# Altium project my_lv_board_db.PrjPcb
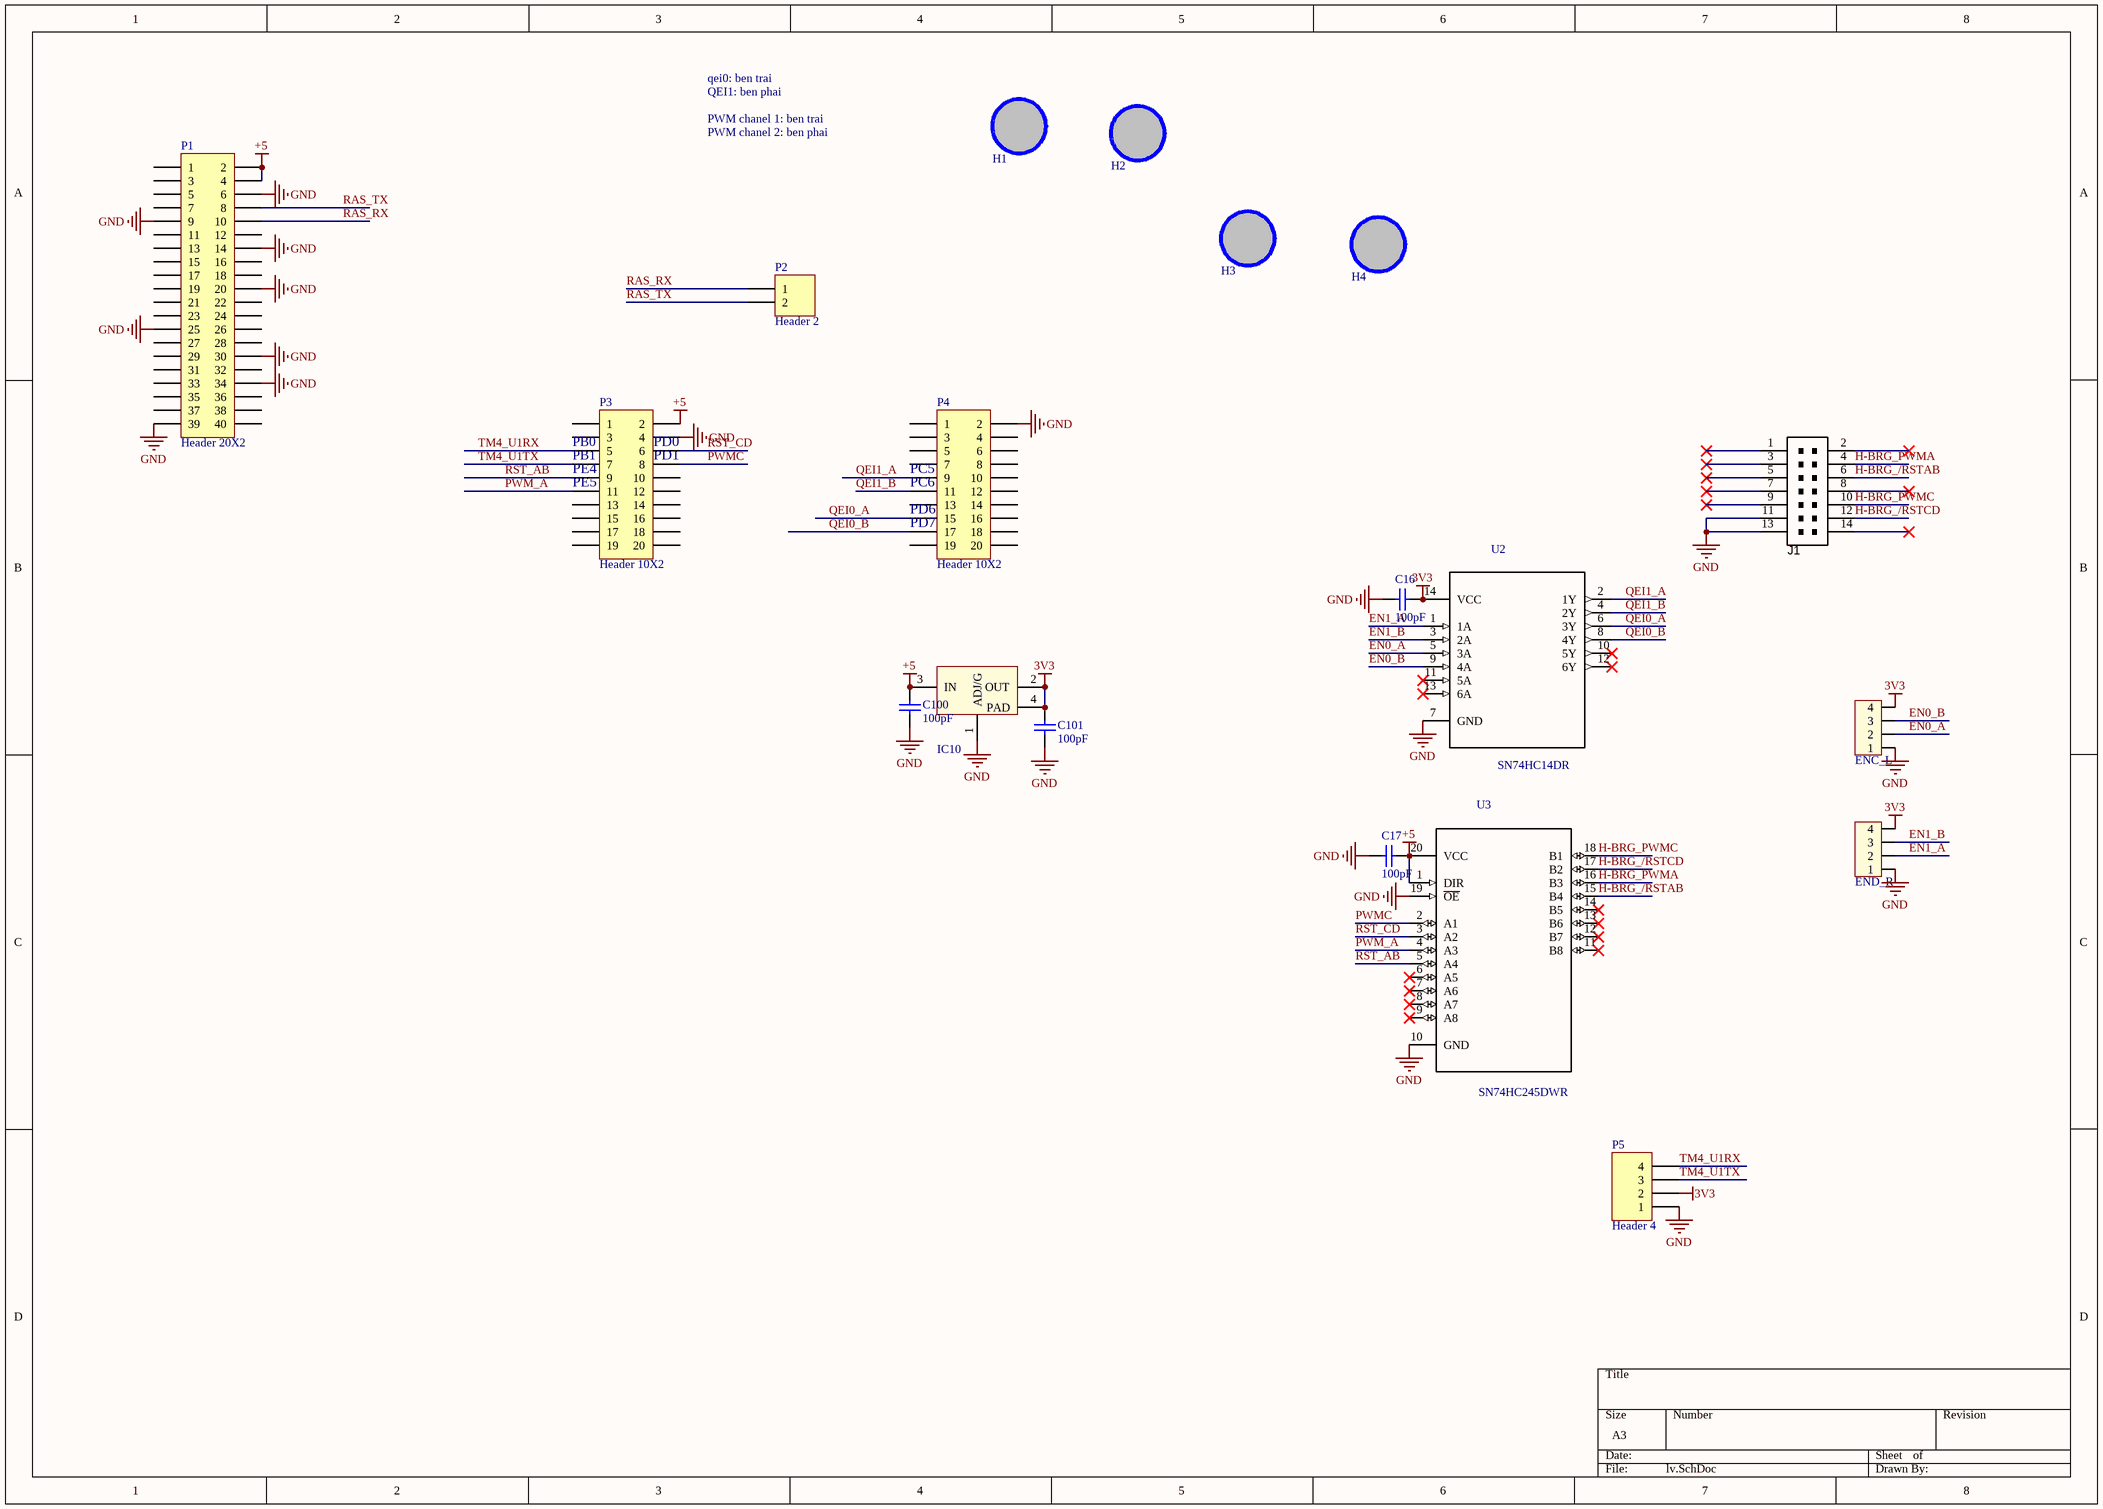
[diagram p0: lv.SchDoc]
2 sheets, 57 parts. Net scope: global (net labels, ports and power ports of the same name join across sheets).
Board file: all.PcbDoc
Sheets:
  lv.SchDoc
  dh.SchDoc

## Sheet lv.SchDoc
size A3

### Parts
C16  value 100pF  [CAP-SM-0805]  (hidden comment: Cap Non-Pol SMD)
C17  value 100pF  [CAP-SM-0805]  (hidden comment: Cap Non-Pol SMD)
C100  value 100pF  [CAP-SM-0805]  (hidden comment: Cap Non-Pol SMD)
C101  value 100pF  [CAP-SM-0805]  (hidden comment: Cap Non-Pol SMD)
ENC_L1  ENC_L  [CON4]
END_R1  END_R  [CON4]
H1  Hole  [LO KHOAN 3MM]  (value not drawn)
H2  Hole  [LO KHOAN 3MM]  (value not drawn)
H3  Hole  [LO KHOAN 3MM]  (value not drawn)
H4  Hole  [LO KHOAN 3MM]  (value not drawn)
IC10  LM1117  [SOT223-4N]  (value not drawn)
J1  shrouded box header  [14P_PCB_HEADER_BRD_MNT_RA]  (value not drawn)
P1  Header 20X2  [HDR2X20]
P2  Header 2  [HDR1X2]
P3  Header 10X2  [HDR2X10]
P4  Header 10X2  [HDR2X10]
P5  Header 4  [HDR1X4]
U2  SN74HC14DR  [*SOIC127P600X175-14N]
U3  SN74HC245DWR  [*SOIC127P1030X265-20N]

### Nets
3V3: C16.1 C101.2 ENC_L1.4 END_R1.4 IC10.2(OUT) IC10.4(PAD) P5.2 U2.14(VCC)
+5: C17.1 C100.2 IC10.3(IN) P1.2 P1.4 P3.2 U3.1(DIR) U3.20(VCC)
GND: C16.2 C17.2 C100.1 C101.1 ENC_L1.1 END_R1.1 IC10.1(ADJ/G) J1.11 J1.13 P1.6 P1.9 P1.14 P1.20 P1.25 P1.30 P1.34 P1.39 P3.4 P4.2 P5.1 U2.7(GND) U3.10(GND) U3.19(~{OE})
EN0_A: ENC_L1.2 U2.5(3A)
EN0_B: ENC_L1.3 U2.9(4A)
EN1_A: END_R1.2 U2.1(1A)
EN1_B: END_R1.3 U2.3(2A)
H-BRG_/RSTAB: J1.6 U3.15(B4)
H-BRG_/RSTCD: J1.12 U3.17(B2)
H-BRG_PWMA: J1.4 U3.16(B3)
H-BRG_PWMC: J1.10 U3.18(B1)
PWM_A: P3.11 U3.4(A3)
PWMC: P3.8 U3.2(A1)
QEI0_A: P4.15 U2.6(3Y)
QEI0_B: P4.17 U2.8(4Y)
QEI1_A: P4.9 U2.2(1Y)
QEI1_B: P4.11 U2.4(2Y)
RAS_RX: P1.10 P2.1
RAS_TX: P1.8 P2.2
RST_AB: P3.9 U3.5(A4)
RST_CD: P3.6 U3.3(A2)
TM4_U1RX: P3.5 P5.4
TM4_U1TX: P3.7 P5.3

Not connected (* = marked no-connect by the designer): H1 1; H2 1; H3 1; H4 1; J1 1* 2* 3* 5* 7* 8* 9* 14*; P1 1 3 5 7 11 12 13 15 16 17 18 19 21 22 23 24 26 27 28 29 31 32 33 35 36 37 38 40; P3 1 3 10 12 13 14 15 16 17 18 19 20; P4 1 3 4 5 6 7 8 10 12 13 14 16 18 19 20; U2 10(5Y)* 11(5A)* 12(6Y)* 13(6A)*; U3 6(A5)* 7(A6)* 8(A7)* 9(A8)* 11(B8)* 12(B7)* 13(B6)* 14(B5)*

### Notes on the sheet
- qei0: ben trai
- QEI1: ben phai
- PWM chanel 1: ben trai
- PWM chanel 2: ben phai
- (near P3) PB0
- (near P3) PD0
- (near P3) PE4
- (near P3) PE5
- (near P3) PB1
- (near P3) PD1
- (near P4) PC5
- (near P4) PC6
- (near P4) PD6
- (near P4) PD7

### Library data of the parts
C16 C17 C100 C101 = Cap Non-Pol SMD: Capacitor
ENC_L1 END_R1 = Con4: Connector 4; Value: Connector 4
H1-H4 = Hole: Hole 3mm
IC10 = LM1117: Available in 1.8V, 2.5V, 2.85V, 3.3V, 5V, and  Adjustable Versions; Value: LM317
J1 = CONN_HEADER_2x7P_RA_0.100in_Male: Header THD 14 POS Double-row right-angle 2.54mm pitch; Manufacturer 1: 3M; Manufacturer Part Number 1: D2514-5002-AR; Pitch: 0.100" (2.54mm); Value: Double-row, 14 positions; QtyOverride: 1; Connector Type: Header, Shrouded; Number of Positions: 14; SCDType: source; Package / Case: Connector header; 2.54mm pitch; Contact Type: Male Pin; Number of Rows: 2; Row Spacing: 0.100" (2.54mm); Contact Mating Length: 0.243" (6.17mm); ComponentLink1URL: http://multimedia.3m.com/mws/mediawebserver?66666UuZjcFSLXTtm8T_oxMcEVuQEcuZgVs6EVs6E666666--; ComponentLink1Description: http://multimedia.3m.com/mws/mediawebserver?66666UuZjcFSLXTtm8T_oxMcEVuQEcuZgVs6EVs6E666666--; Supplier 1: Digi-Key; Supplier Part Number 1: MHE14E-ND
P1 = Header 20X2: Header, 20-Pin, Dual row; LatestRevisionDate: 17-Jul-2002; LatestRevisionNote: Re-released for DXP Platform.; Publisher: Altium Limited
P2 = Header 2: Header, 2-Pin; LatestRevisionDate: 17-Jul-2002; LatestRevisionNote: Re-released for DXP Platform.; Publisher: Altium Limited
P3 P4 = Header 10X2: Header, 10-Pin, Dual row; LatestRevisionDate: 17-Jul-2002; LatestRevisionNote: Re-released for DXP Platform.; Publisher: Altium Limited
P5 = Header 4: Header, 4-Pin; LatestRevisionDate: 17-Jul-2002; LatestRevisionNote: Re-released for DXP Platform.; Publisher: Altium Limited
U2 = SN74HC14DR: Inverter Schmitt Trigger 6-Element CMOS 14-Pin SOIC T/R; MF: Texas Instruments; Price: None; Availability: Unavailable; MP: SN74HC14DR; Package: SOIC-14 Texas Instruments; SnapEDA_Link: https://www.snapeda.com/parts/SN74HC14DR/Texas%20Instruments/view-part/?ref=snap; Value: *
U3 = SN74HC245DWR: Logic IC - Receiver, transceiver Texas Instruments SN74HC245DWR SOIC 20; Price: None; Availability: Unavailable; MP: SN74HC245DWR; Package: SOIC-20 Texas Instruments; SnapEDA_Link: https://www.snapeda.com/parts/SN74HC245DWR/Texas%20Instruments/view-part/?ref=snap; MF: Texas Instruments; Value: *

## Sheet dh.SchDoc
size A
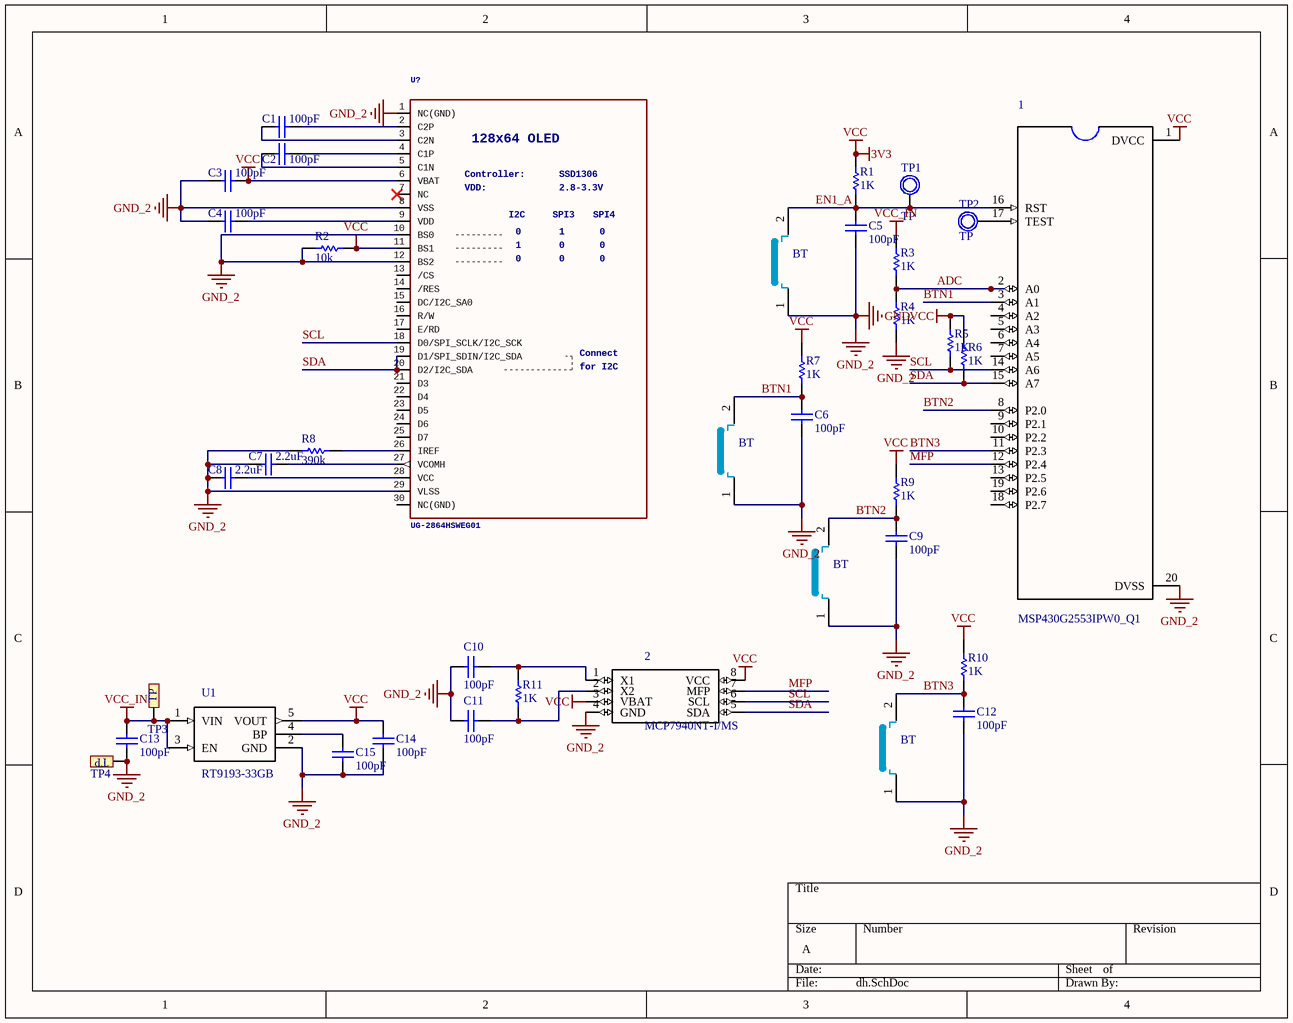
[diagram p1: dh.SchDoc]

### Parts
1  MSP430G2553IPW0_Q1  [*TSSOP-20]
2  MCP7940NT-I/MS  [*SOP65P640X120-8N]
BT1  BT  [SW-SMD]
BT2  BT  [SW-SMD]
BT3  BT  [SW-SMD]
BT4  BT  [SW-SMD]
C1  value 100pF  [CAP-SM-0603]  (hidden comment: Cap Non-Pol SMD)
C2  value 100pF  [CAP-SM-0603]  (hidden comment: Cap Non-Pol SMD)
C3  value 100pF  [CAP-SM-0603]  (hidden comment: Cap Non-Pol SMD)
C4  value 100pF  [CAP-SM-0603]  (hidden comment: Cap Non-Pol SMD)
C5  value 100pF  [CAP-SM-0603]  (hidden comment: Cap Non-Pol SMD)
C6  value 100pF  [CAP-SM-0603]  (hidden comment: Cap Non-Pol SMD)
C7  value 2.2uF  [CAP-SM-0603]  (hidden comment: Cap Non-Pol SMD)
C8  value 2.2uF  [CAP-SM-0603]  (hidden comment: Cap Non-Pol SMD)
C9  value 100pF  [CAP-SM-0603]  (hidden comment: Cap Non-Pol SMD)
C10  value 100pF  [CAP-SM-0603]  (hidden comment: Cap Non-Pol SMD)
C11  value 100pF  [CAP-SM-0603]  (hidden comment: Cap Non-Pol SMD)
C12  value 100pF  [CAP-SM-0603]  (hidden comment: Cap Non-Pol SMD)
C13  value 100pF  [CAP-SM-0603]  (hidden comment: Cap Non-Pol SMD)
C14  value 100pF  [CAP-SM-0603]  (hidden comment: Cap Non-Pol SMD)
C15  value 100pF  [CAP-SM-0603]  (hidden comment: Cap Non-Pol SMD)
R1  value 1K  [RES-SM-0603]  (hidden comment: RESISTOR SMD)
R2  value 10k  [RES-SM-0603]  (hidden comment: RESISTOR SMD)
R3  value 1K  [RES-SM-0603]  (hidden comment: RESISTOR SMD)
R4  value 1K  [RES-SM-0603]  (hidden comment: RESISTOR SMD)
R5  value 1K  [RES-SM-0603]  (hidden comment: RESISTOR SMD)
R6  value 1K  [RES-SM-0603]  (hidden comment: RESISTOR SMD)
R7  value 1K  [RES-SM-0603]  (hidden comment: RESISTOR SMD)
R8  value 390k  [RES-SM-0603]  (hidden comment: RESISTOR SMD)
R9  value 1K  [RES-SM-0603]  (hidden comment: RESISTOR SMD)
R10  value 1K  [RES-SM-0603]  (hidden comment: RESISTOR SMD)
R11  value 1K  [RES-SM-0603]  (hidden comment: RESISTOR SMD)
TP1  TP  [TP1]
TP2  TP  [TP1]
TP3  Test Point  [TP]  (value not drawn)
TP4  Test Point  [TP]  (value not drawn)
U1  RT9193-33GB  [*SOT94P279X129-5N]
U?  UG-2864HSWEG01  128x64OLED: 128x64 OLED  forI2C: for I2C  Controller: Controller:  VDD: VDD:  [my_footprint]

### Nets
3V3: 1.1(DVCC) 2.3(VBAT) 2.8(VCC) C3.2 C14.2 R1.2 R2.2 R5.2 R6.2 R7.2 R9.2 R10.2 U1.5(VOUT) U?.6(VBAT) U?.11(BS1)  [also labelled VCC]
GND: 1.20(DVSS) 2.4(GND) BT1.1 BT2.1 BT3.1 BT4.1 C3.1 C4.1 C5.1 C6.1 C7.1 C8.1 C9.1 C10.1 C11.1 C12.1 C13.1 C14.1 C15.1 R2.1 R4.1 R8.1 TP4.TP1 U1.2(GND) U?.1(NC(GND)) U?.8(VSS) U?.10(BS0) U?.12(BS2) U?.29(VLSS)  [also labelled GND_2]
VCC_IN: C13.2 R3.2 TP3.TP1 U1.1(VIN) U1.3(EN)
ADC: 1.2(A0) R3.1 R4.2
BTN1: 1.3(A1) BT2.2 C6.2 R7.1
BTN2: 1.8(P2.0) BT3.2 C9.2 R9.1
BTN3: 1.11(P2.3) BT4.2 C12.2 R10.1
EN1_A: 1.16(RST) BT1.2 C5.2 R1.1 TP1.1
MFP: 1.12(P2.4) 2.7(MFP)
SCL: 1.14(A6) 2.6(SCL) R5.1 U?.18(D0/SPI_SCLK/I2C_SCK)
SDA: 1.15(A7) 2.5(SDA) R6.1 U?.19(D1/SPI_SDIN/I2C_SDA) U?.20(D2/I2C_SDA)
Net1_17: 1.17(TEST) TP2.1
Net2_1: 2.1(X1) C10.2 R11.2
Net2_2: 2.2(X2) C11.2 R11.1
NetC1_1: C1.1 U?.3(C2N)
NetC1_2: C1.2 U?.2(C2P)
NetC2_1: C2.1 U?.5(C1N)
NetC2_2: C2.2 U?.4(C1P)
NetC4_2: C4.2 U?.9(VDD)
NetC7_2: C7.2 U?.27(VCOMH)
NetC8_2: C8.2 U?.28(VCC)
NetC15_2: C15.2 U1.4(BP)
NetR8_2: R8.2 U?.26(IREF)

Not connected (* = marked no-connect by the designer): 1 4(A2) 5(A3) 6(A4) 7(A5) 9(P2.1) 10(P2.2) 13(P2.5) 18(P2.7) 19(P2.6); U? 7(NC)* 13(/CS) 14(/RES) 15(DC/I2C_SA0) 16(R/W) 17(E/RD) 21(D3) 22(D4) 23(D5) 24(D6) 25(D7) 30(NC(GND))

### Notes on the sheet
- (in symbol Test Point) TP

### Library data of the parts
1 = MSP430G2553IPW0_Q1: MSP430? Ultra-Low-Power Microcontrollers for Automotive Applications 20-TSSOP -40 to 85; MP: MSP430G2553IPW0 Q1; MF: Texas Instruments; Price: None; Availability: Unavailable; Package: TSSOP-20 Texas Instruments; SnapEDA_Link: https://www.snapeda.com/parts/MSP430G2553IPW0%20Q1/Texas%20Instruments/view-part/?ref=snap; Value: *
2 = MCP7940NT-I/MS: Real Time Clock Serial 64Byte 8-Pin MSOP T/R; MF: Microchip; Price: None; Availability: Unavailable; MP: MCP7940NT-I/MS; Package: MSOP-8 Microchip; SnapEDA_Link: https://www.snapeda.com/parts/MCP7940NT-I/MS/Microchip/view-part/?ref=snap; Value: *
BT1-BT4 = BUTTON
C1-C15 = Cap Non-Pol SMD: Capacitor
R1-R11 = RESISTOR SMD: Resistor
TP1 TP2 = TP1: Test Point; Value: Test Point
U1 = RT9193-33GB: RT9193 Series 300 mA 3.3 V Ultra-Low Noise Ultra-Fast CMOS LDO Regulator-SC-70-5; MF: Richtek USA; MP: RT9193-33GB; Package: SOT-23-5 Richtek; Availability: Unavailable; Price: None; SnapEDA_Link: https://www.snapeda.com/parts/RT9193-33GB/Richtek%20USA%20Inc./view-part/?ref=snap; Value: *
U? = DISP_OLED_UG-2864HSWEG010.96": UG-2864HSWEG01 OLED display Both 1.3" and 0.96" models share the same FPC tab footprint, only the screen dimensions vary.; GateName_1: G$1; SymbolName_1: UG-2864HSWEG01; DeviceName: 0.96"; LibraryName: microbuilder; DeviceSetName: DISP_OLED_UG-2864HSWEG01; I2C: I2C; SPI3: SPI3; 0: 0; 1: 1; Connect: Connect; SSD1306: SSD1306; 2.8-3.3V: 2.8-3.3V; SPI4: SPI4

## Nets that join several sheets
3V3: lv (8 pins), dh (15 pins)
GND: lv (23 pins), dh (29 pins)
EN1_A: lv (END_R1.2 U2.1), dh (5 pins)